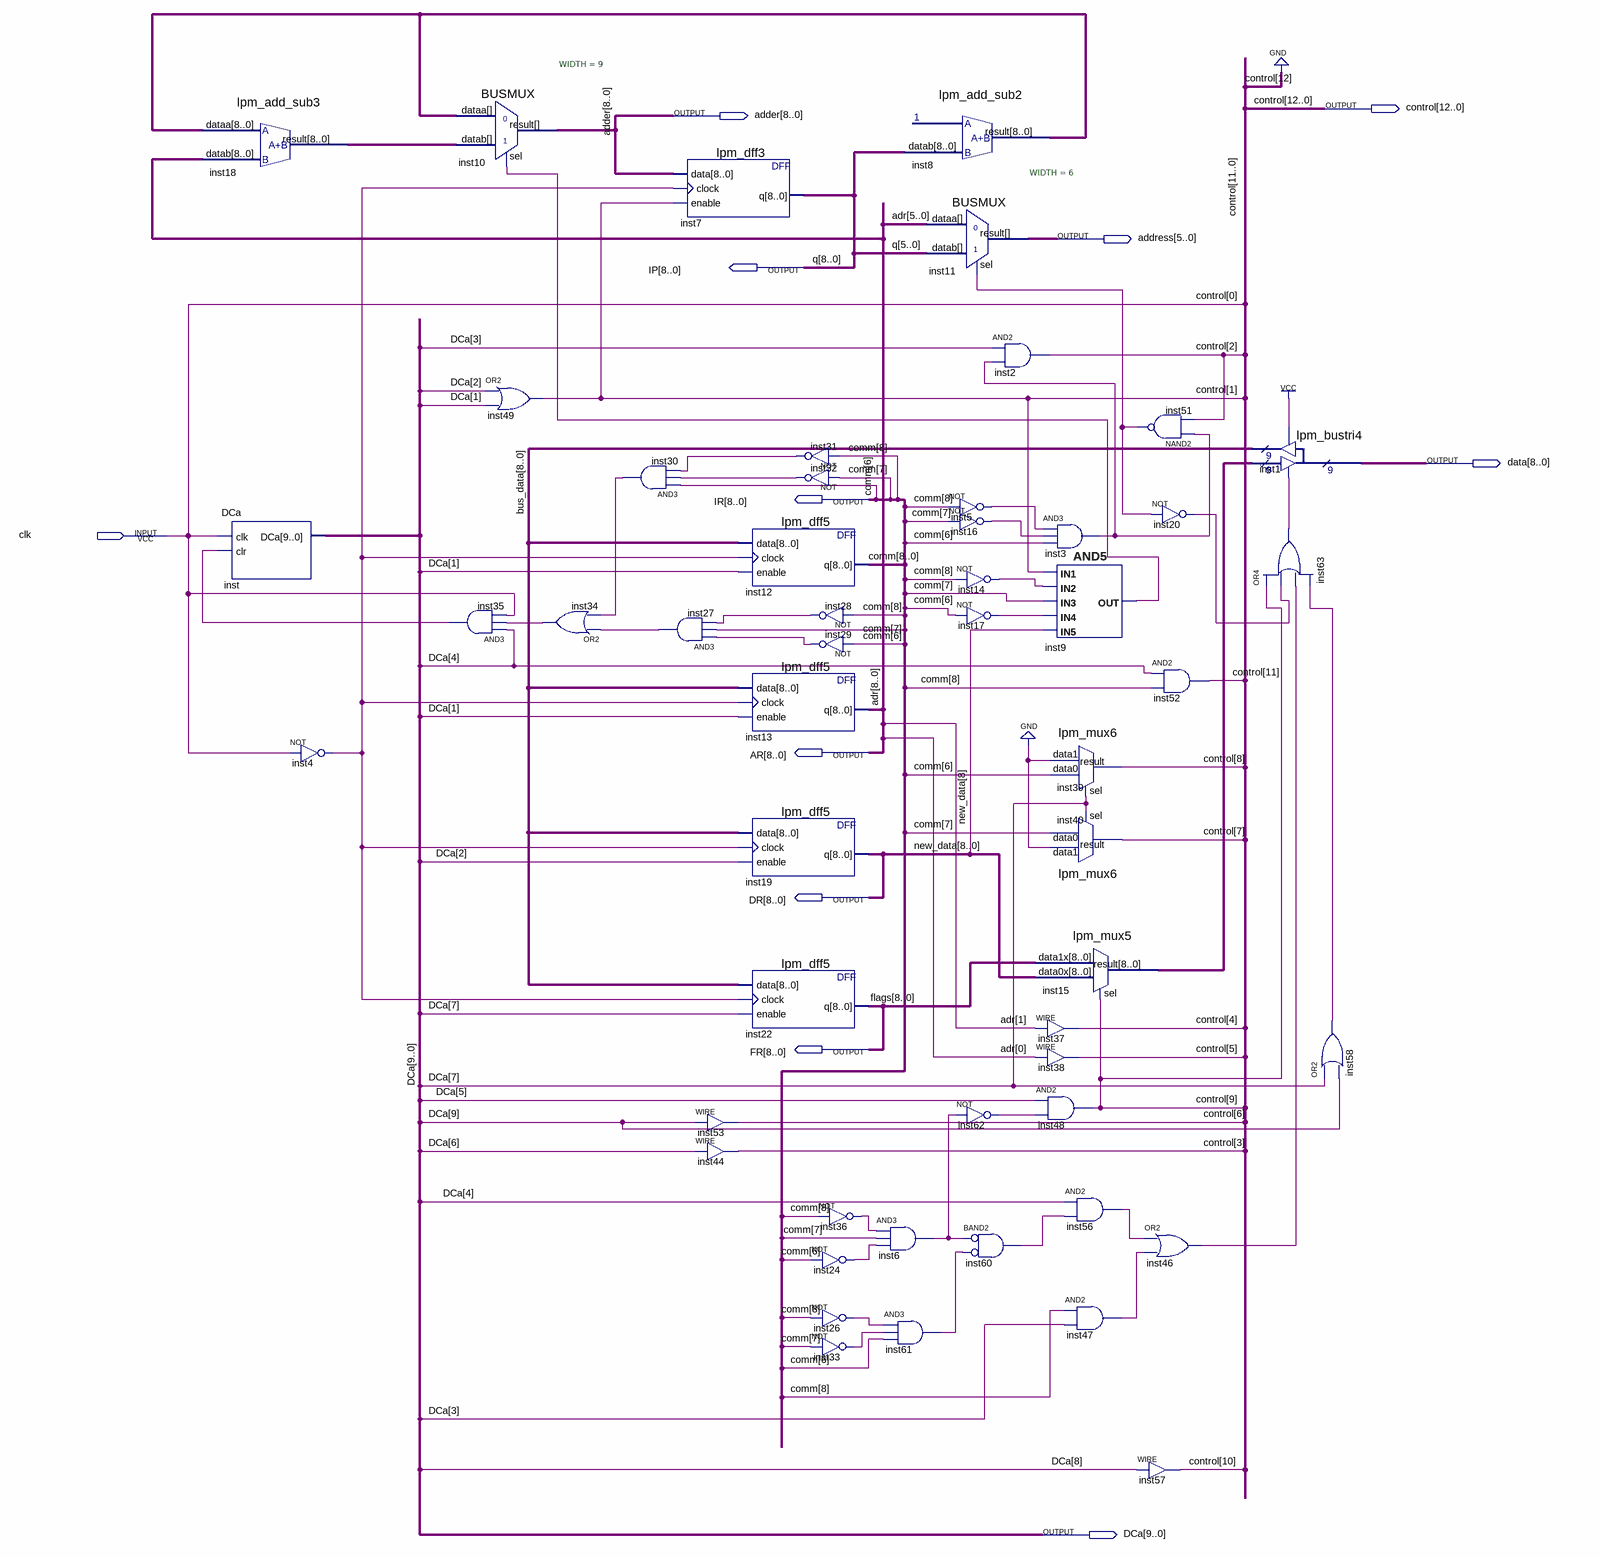
[diagram p0: schematic sheet]
// Quartus schematic cu.bdf as structural Verilog: 53 symbols, 11 pins
module cu (
  input  clk,
  output [12:0] control,
  output [8:0] adder,
  output [5:0] address,
  output [8:0] IP,
  output [8:0] data,
  output [8:0] IR,
  output [8:0] AR,
  output [8:0] DR,
  output [8:0] FR,
  output [9:0] DCa
);

  wire inst3_out, inst4_out, inst5_out, inst6_out, inst9_out, inst14_out, inst16_out, inst17_out, inst20_out,
       inst24_out, inst26_out, inst27_out, inst28_out, inst29_out, inst30_out, inst31_out, inst32_out,
       inst33_out, inst34_out, inst35_out, inst36_out, inst46_out, inst47_out, inst51_out, inst56_out,
       inst58_out, inst60_out, inst61_out, inst62_out, inst63_out;
  wire [8:0] bus_data, inst8_result, inst15_result, inst18_result;

  lpm_add_sub3 inst18 (.dataa(inst8_result), .datab(AR), .result(inst18_result));
  DCa inst (.clk(clk), .clr(inst35_out), .DCa(DCa));
  not inst4 (inst4_out, clk);
  BUSMUX #(.WIDTH(9)) inst10 (.datab(inst18_result), .sel(inst9_out), .dataa(inst8_result), .result(adder));
  and inst35 (inst35_out, DCa[4], inst34_out, clk);
  or inst49 (control[1], DCa[2], DCa[1]);
  or inst34 (inst34_out, inst27_out, inst30_out);
  and inst30 (inst30_out, IR[6], inst32_out, inst31_out);
  lpm_dff3 inst7 (.data(adder), .clock(inst4_out), .enable(control[1]), .q(IP));
  and inst27 (inst27_out, inst29_out, IR[7], inst28_out);
  assign control[6] = DCa[9];  // WIRE inst53
  assign control[3] = DCa[6];  // WIRE inst44
  lpm_dff5 inst12 (.data(bus_data), .clock(inst4_out), .enable(DCa[1]), .q(IR));
  lpm_dff5 inst13 (.data(bus_data), .clock(inst4_out), .enable(DCa[1]), .q(AR));
  lpm_dff5 inst19 (.data(bus_data), .clock(inst4_out), .enable(DCa[2]), .q(DR));
  lpm_dff5 inst22 (.data(bus_data), .clock(inst4_out), .enable(DCa[7]), .q(FR));
  not inst31 (inst31_out, IR[8]);
  not inst32 (inst32_out, IR[7]);
  not inst28 (inst28_out, IR[8]);
  not inst29 (inst29_out, IR[6]);
  not inst36 (inst36_out, IR[8]);
  not inst24 (inst24_out, IR[6]);
  not inst26 (inst26_out, IR[8]);
  not inst33 (inst33_out, IR[7]);
  and inst6 (inst6_out, inst36_out, IR[7], inst24_out);
  and inst61 (inst61_out, inst26_out, inst33_out, IR[6]);
  lpm_add_sub2 inst8 (.datab(IP), .result(inst8_result));
  BUSMUX #(.WIDTH(6)) inst11 (.datab(IP[5:0]), .sel(inst51_out), .dataa(AR[5:0]), .result(address));
  and inst2 (control[2], DCa[3], inst3_out);
  not inst5 (inst5_out, IR[8]);
  not inst16 (inst16_out, IR[7]);
  not inst14 (inst14_out, IR[8]);
  not inst17 (inst17_out, IR[6]);
  not inst62 (inst62_out, inst6_out);
  and inst60 (inst60_out, ~inst6_out, ~inst61_out);  // BAND2
  and inst3 (inst3_out, inst5_out, inst16_out, IR[6]);
  and inst9 (inst9_out, control[1], inst14_out, IR[7], inst17_out, DR[8]);
  lpm_mux6 inst39 (.data1(1'b0), .data0(IR[6]), .sel(DCa[7]), .result(control[8]));
  lpm_mux6 inst40 (.data1(1'b0), .data0(IR[7]), .sel(DCa[7]), .result(control[7]));
  lpm_mux5 inst15 (.data1x(FR), .data0x(DR), .sel(control[9]), .result(inst15_result));
  assign control[4] = AR[1];  // WIRE inst37
  assign control[5] = AR[0];  // WIRE inst38
  and inst48 (control[9], DCa[5], inst62_out);
  and inst56 (inst56_out, DCa[4], inst60_out);
  and inst47 (inst47_out, IR[8], DCa[3]);
  nand inst51 (inst51_out, inst3_out, control[2]);
  not inst20 (inst20_out, inst51_out);
  and inst52 (control[11], DCa[4], IR[8]);
  or inst46 (inst46_out, inst56_out, inst47_out);
  assign control[10] = DCa[8];  // WIRE inst57
  lpm_bustri4 inst1 (.enabledt(inst63_out), .data(inst15_result), .enabletr(1'b1), .result(bus_data), .tridata(data));
  or inst63 (inst63_out, control[9], inst20_out, inst46_out, inst58_out);
  or inst58 (inst58_out, DCa[7], DCa[9]);

  assign {control[12], control[0]} = {1'b0, clk};

  // Other names for the same wires on the sheet: adr[8:0] = AR; comm[8:0] = IR; new_data[8:0] = DR; flags[8:0] = FR;
  //   q[8:0] = IP
endmodule
